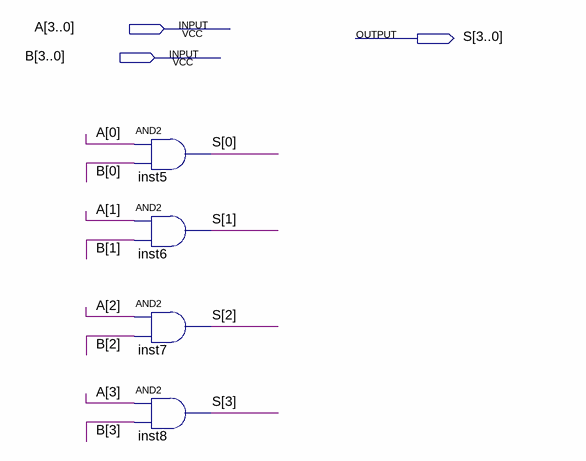
[diagram p0: schematic sheet]
// Quartus schematic AND4_4.bdf as structural Verilog: 4 symbols, 3 pins
module AND4_4 (
  input  [3:0] A,
  input  [3:0] B,
  output [3:0] S
);

  and inst5 (S[0], A[0], B[0]);
  and inst6 (S[1], A[1], B[1]);
  and inst7 (S[2], A[2], B[2]);
  and inst8 (S[3], A[3], B[3]);
endmodule
